# Altium schematic sheet wisp-6-mcu.SchDoc: MCU
size B; SheetNumber: 2; SheetTotal: 4
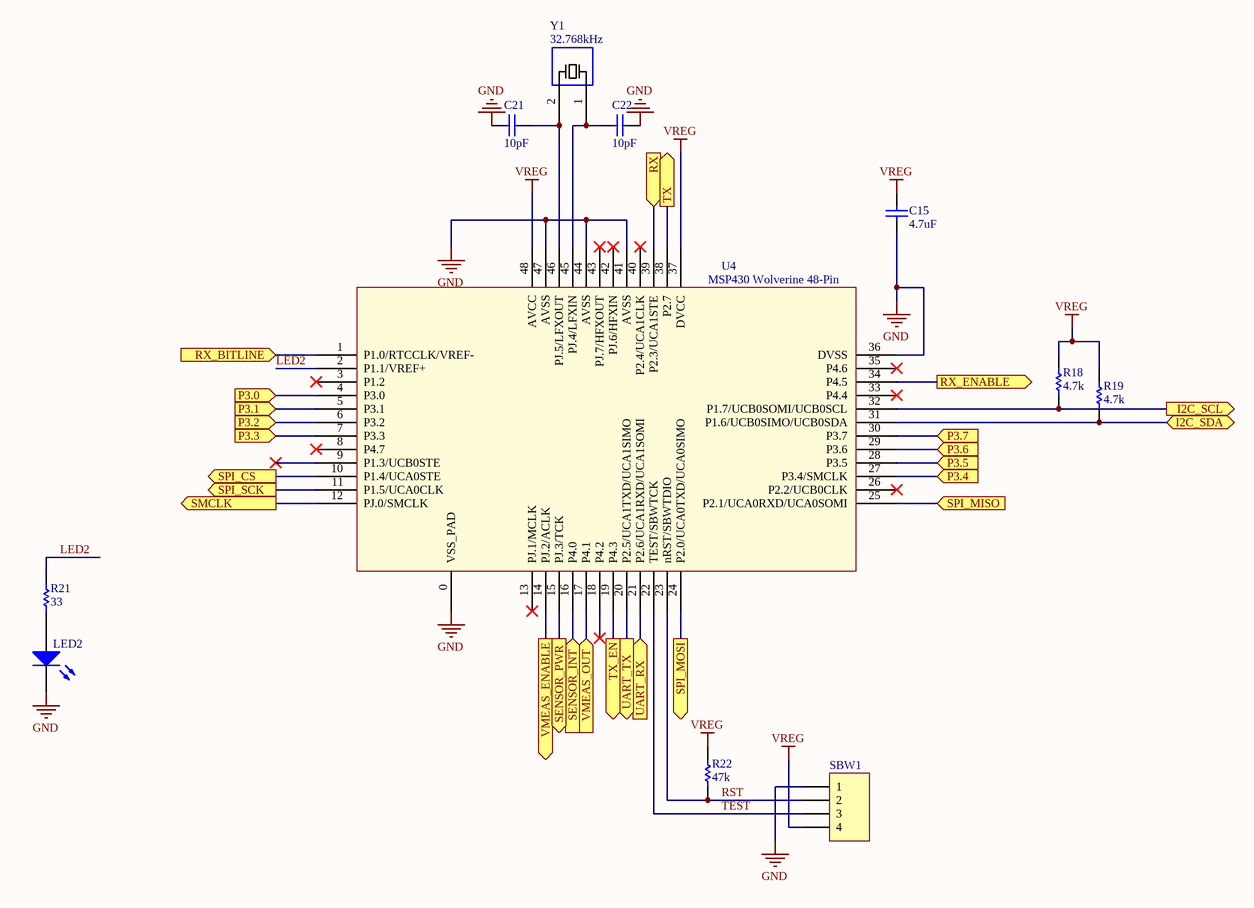
[diagram p0: wisp-6-mcu.SchDoc]

## Parts
C15  value 4.7uF  [0402]  (hidden comment: Cap)
C21  value 10pF  [0402]  (hidden comment: Cap)
C22  value 10pF  [0402]  (hidden comment: Cap)
LED2  LED  [Diode - 0603]  (value not drawn)
R18  value 4.7k  [0402]  (hidden comment: Res)
R19  value 4.7k  [0402]  (hidden comment: Res)
R21  value 33  [0402]  (hidden comment: Res)
R22  value 47k  [0402]  (hidden comment: Res)
SBW1  MHDR1X4  [MHDR1X4]  (value not drawn)
U4  MSP430 Wolverine 48-Pin  [MSP_QFN48_RGZ_PAD0]
Y1  value 32.768kHz  [XTAL [3.20mm x 1.50mm]]  (hidden comment: XTAL)

## Ports
I2C_SCL (out), I2C_SDA (bidir), P3.0 (in), P3.1 (in), P3.2 (in), P3.3 (in), P3.4 (in), P3.5 (in), P3.6 (in), P3.7 (in), RX (in), RX_BITLINE (in), RX_ENABLE (out), SENSOR_INT (in), SENSOR_PWR (out), SMCLK (out), SPI_CS (out), SPI_MISO (in), SPI_MOSI (out), SPI_SCK (out), TX (out), TX_EN (out), UART_RX (in), UART_TX (out), VMEAS_ENABLE (out), VMEAS_OUT (in)

## Nets
GND: C15.1 C21.1 C22.1 LED2.2(K) SBW1.1 U4.0(VSS_PAD) U4.36(DVSS) U4.41(AVSS) U4.44(AVSS) U4.47(AVSS)
VREG: C15.2 R18.2 R19.2 R22.2 SBW1.4 U4.37(DVCC) U4.48(AVCC)
I2C_SCL: R18.1 U4.32(P1.7/UCB0SOMI/UCB0SCL) ; port I2C_SCL
I2C_SDA: R19.1 U4.31(P1.6/UCB0SIMO/UCB0SDA) ; port I2C_SDA
LED2: R21.2 U4.2(P1.1/VREF+)
P3.0: U4.4(P3.0) ; port P3.0
P3.1: U4.5(P3.1) ; port P3.1
P3.2: U4.6(P3.2) ; port P3.2
P3.3: U4.7(P3.3) ; port P3.3
P3.4: U4.27(P3.4/SMCLK) ; port P3.4
P3.5: U4.28(P3.5) ; port P3.5
P3.6: U4.29(P3.6) ; port P3.6
P3.7: U4.30(P3.7) ; port P3.7
RST: R22.1 SBW1.2 U4.23(nRST/SBWTDIO)
RX: U4.39(P2.3/UCA1STE) ; port RX
RX_BITLINE: U4.1(P1.0/RTCCLK/VREF-) ; port RX_BITLINE
RX_ENABLE: U4.34(P4.5) ; port RX_ENABLE
SENSOR_INT: U4.16(P4.0) ; port SENSOR_INT
SENSOR_PWR: U4.15(PJ.3/TCK) ; port SENSOR_PWR
SMCLK: U4.12(PJ.0/SMCLK) ; port SMCLK
SPI_CS: U4.10(P1.4/UCA0STE) ; port SPI_CS
SPI_MISO: U4.25(P2.1/UCA0RXD/UCA0SOMI) ; port SPI_MISO
SPI_MOSI: U4.24(P2.0/UCA0TXD/UCA0SIMO) ; port SPI_MOSI
SPI_SCK: U4.11(P1.5/UCA0CLK) ; port SPI_SCK
TEST: SBW1.3 U4.22(TEST/SBWTCK)
TX: U4.38(P2.7) ; port TX
TX_EN: U4.19(P4.3) ; port TX_EN
UART_RX: U4.21(P2.6/UCA1RXD/UCA1SOMI) ; port UART_RX
UART_TX: U4.20(P2.5/UCA1TXD/UCA1SIMO) ; port UART_TX
VMEAS_ENABLE: U4.14(PJ.2/ACLK) ; port VMEAS_ENABLE
VMEAS_OUT: U4.17(P4.1) ; port VMEAS_OUT
NetC21_2: C21.2 U4.46(PJ.5/LFXOUT) Y1.2
NetC22_2: C22.2 U4.45(PJ.4/LFXIN) Y1.1
NetLED2_1: LED2.1(A) R21.1

Not connected (* = marked no-connect by the designer): U4 3(P1.2)* 8(P4.7)* 9(P1.3/UCB0STE)* 13(PJ.1/MCLK)* 18(P4.2)* 26(P2.2/UCB0CLK)* 33(P4.4)* 35(P4.6)* 40(P2.4/UCA1CLK)* 42(PJ.6/HFXIN)* 43(PJ.7/HFXOUT)*

## Library data of the parts
C15 C21 C22 = Cap: Ceramic Capacitor (Surface Mount); Manufacturer: Generic Ceramic Chip Cap (TBD); Digi-Key Part Number: *; Manufacturer Part Number: *; Note: *; Rating: *
LED2 = Diode - LED: Typical RED, GREEN, YELLOW, AMBER GaAs LED; Digi-Key Part Number: *; Manufacturer: *; Manufacturer Part Number: *; Note: *; Value: *; Rating: *
R18 R19 R21 R22 = Res: Chip Resistor (Surface Mount); Manufacturer: Generic Chip Res (TBD); Manufacturer Part Number: *; Digi-Key Part Number: *; Rating: *
  R21 R22: Note: *
SBW1 = MHDR1X4: Header, 4-Pin; LatestRevisionDate: 17-Jul-2002; LatestRevisionNote: Re-released for DXP Platform.; Publisher: Altium Limited
U4 = MSP430FR596X_586X_RGZ: 16-bit FRAM MCU; Manufacture: Texas Instrument; PartNumber: MSP430FR5969; Datasheet Link: http://www.ti.com/lit/gpn/msp430fr5969
Y1 = XTAL 2-pins: Crystal Oscillator - [3.20mm x 1.50mm]; Manufacturer: Epson Toyocom Corporation; Manufacturer Part Number: FC-135 32.7680KA-A3; Digi-Key Part Number: example: SE2413CT-ND